# EAGLE schematic woolston_adsr (EAGLE 7.1.0)
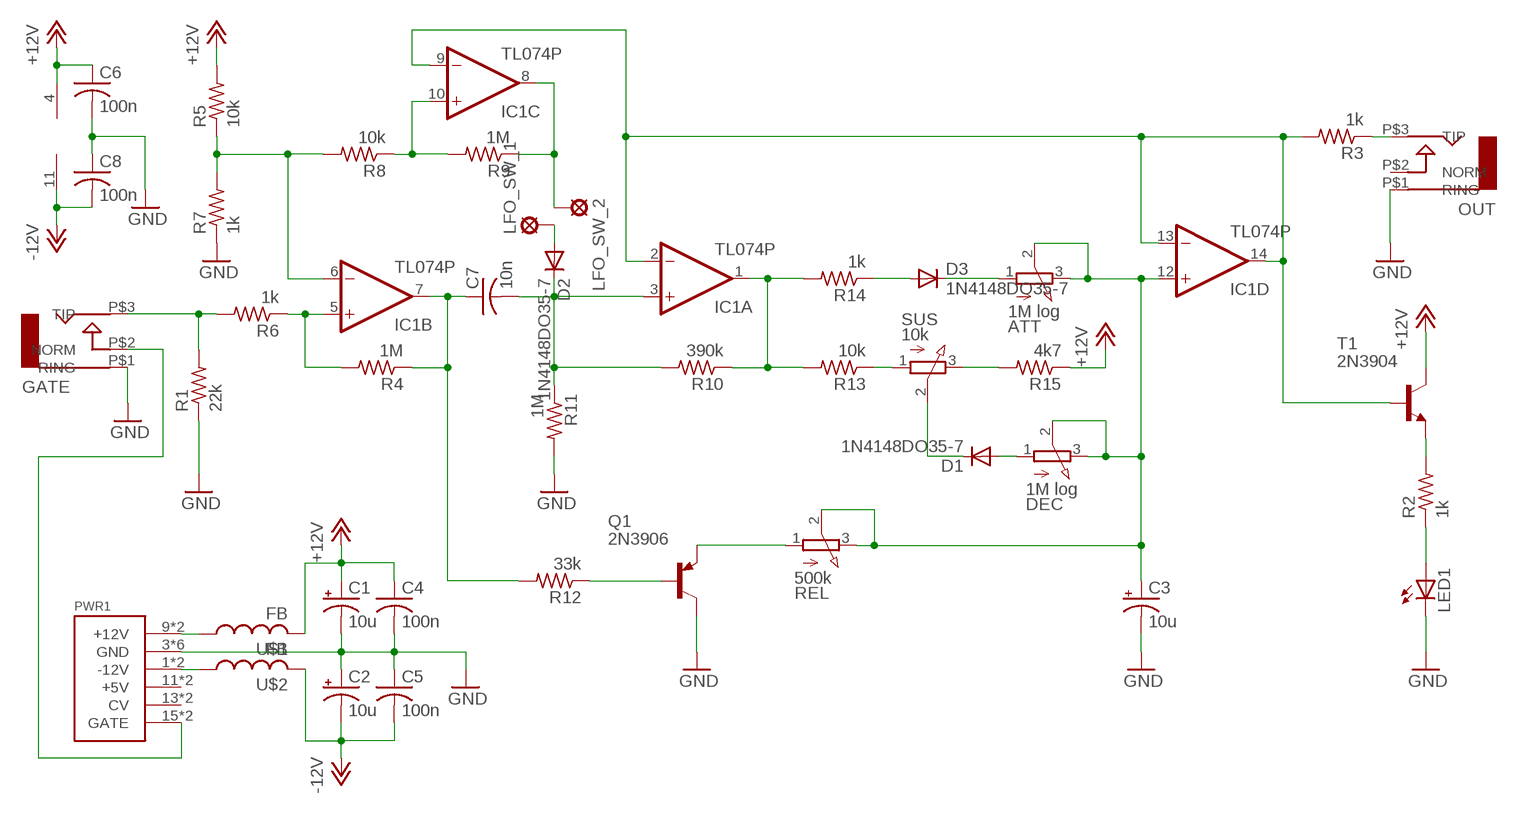
[diagram p0: schematic, sheet 1]

## Parts
ATT  1M log  3RP/1610N  [3RP/1610N]
C1  10u  CPOL-USB45181A  [B45181A]
C2  10u  CPOL-USB45181A  [B45181A]
C3  10u  CPOL-USB45181A  [B45181A]
C4  100n  C-US050-024X044  [C050-024X044]
C5  100n  C-US050-024X044  [C050-024X044]
C6  100n  C-US050-024X044  [C050-024X044]
C7  10n  C-US050-024X044  [C050-024X044]
C8  100n  C-US050-024X044  [C050-024X044]
D1  1N4148DO35-7  [DO35-7]
D2  1N4148DO35-7  [DO35-7]
D3  1N4148DO35-7  [DO35-7]
DEC  1M log  3RP/1610N  [3RP/1610N]
GATE  AUDIO-JACK  [ERTHENVAR-JACK-90DEG]
IC1  TL074P  [DIL14]
LED1  LED5MM  [LED5MM]
LFO_SW_1  LSP11  [LSP11]
LFO_SW_2  LSP11  [LSP11]
OUT  AUDIO-JACK  [ERTHENVAR-JACK-90DEG]
PWR1  POWER  [POWER_16]
Q1  2N3906  [TO92]
R1  22k  R-US_0207/10  [0207/10]
R2  1k  R-US_0207/10  [0207/10]
R3  1k  R-US_0207/10  [0207/10]
R4  1M  R-US_0207/10  [0207/10]
R5  10k  R-US_0207/10  [0207/10]
R6  1k  R-US_0207/10  [0207/10]
R7  1k  R-US_0207/10  [0207/10]
R8  10k  R-US_0207/10  [0207/10]
R9  1M  R-US_0207/10  [0207/10]
R10  390k  R-US_0207/10  [0207/10]
R11  1M  R-US_0207/10  [0207/10]
R12  33k  R-US_0207/10  [0207/10]
R13  10k  R-US_0207/10  [0207/10]
R14  1k  R-US_0207/10  [0207/10]
R15  4k7  R-US_0207/10  [0207/10]
REL  500k  3RP/1610N  [3RP/1610N]
SUS  10k  3RP/1610N  [3RP/1610N]
T1  2N3904  [TO92]
U$1  FB  [FB]
U$2  FB  [FB]

## Nets
+12V: C1.+ C4.1 C6.1 IC1.4(P:V+) R5.2 R15.1 T1.1(C) U$1.P$2
-12V: C2.- C5.2 C8.2 IC1.11(P:V-) U$2.P$2
GND: C1.- C2.+ C3.- C4.2 C5.1 C6.2 C8.1 GATE.P$1(RING) LED1.K(C) OUT.P$1(RING) PWR1.3(GND) PWR1.4(GND) PWR1.5(GND) PWR1.6(GND) PWR1.7(GND) PWR1.8(GND) Q1.1(C) R1.1 R7.1 R11.2
N$1: PWR1.9(+12V) PWR1.10(+12V) U$1.P$1
N$2: PWR1.1(-12V) PWR1.2(-12V) U$2.P$1
N$3: Q1.3(E) REL.1(A)
N$4: C7.1 IC1.7(B:OUT) R4.1 R12.2
N$5: R2.2 T1.3(E)
N$6: IC1.5(B:+IN) R4.2 R6.1
N$7: IC1.6(B:-IN) R5.1 R7.2 R8.2
N$8: LED1.A R2.1
N$9: D2.A LFO_SW_1.MP
N$10: IC1.10(C:+IN) R8.1 R9.2
N$11: Q1.2(B) R12.1
N$12: GATE.P$2(NORM) PWR1.15(GATE) PWR1.16(GATE)
N$13: IC1.8(C:OUT) LFO_SW_2.MP R9.1
N$14: GATE.P$3(TIP) R1.2 R6.2
N$15: OUT.P$3(TIP) R3.1
N$16: R13.1 SUS.1(A)
N$18: C7.2 D2.C IC1.3(A:+IN) R10.2 R11.1
N$19: IC1.2(A:-IN) IC1.9(C:-IN) IC1.13(D:-IN) IC1.14(D:OUT) R3.2 T1.2(B)
N$20: IC1.1(A:OUT) R10.1 R13.2 R14.2
N$21: D3.A R14.1
N$22: R15.2 SUS.3(E)
N$23: ATT.1(A) D3.C
N$24: D1.A DEC.1(A)
N$25: D1.C SUS.2(S)
N$26: ATT.2(S) ATT.3(E) C3.+ DEC.2(S) DEC.3(E) IC1.12(D:+IN) REL.2(S) REL.3(E)
Unconnected: OUT.P$2(NORM) PWR1.11(+5V) PWR1.12(+5V) PWR1.13(CV) PWR1.14(CV)

## Library data of the parts
ATT DEC REL SUS = pot:3RP/1610N: 16mm Potentiometer one level Source: http://www.alphapotentiometers.net/html/16mm_pot_2.html
C1-C3 = rcl:CPOL-US: POLARIZED CAPACITOR, American symbol
C4-C8 = rcl:C-US: CAPACITOR, American symbol
D1-D3 = diode:1N4148: DIODE high speed (Philips)
GATE OUT = erthenvar:AUDIO-JACK: Switching Mono 3.5mm Audio Jack from Erthenvar.
IC1 = linear:TL074: OP AMP
LED1 = led:LED: LED OSRAM: - CHIPLED LG R971, LG N971, LY N971, LG Q971, LY Q971, LO R971, LY R971 LH N974, LH R974 LS Q976, LO Q976, LY Q976 LO Q996 - Hyper CHIPLED LW Q18S LB Q993, LB Q99A, LB R99A - SideLED LS A670, LO A670, LY A670, LG A670, LP A670 LB A673, LV A673, LT A673, LW A673 LH A674 LY A675 LS A676, LA A676, LO A676, LY A676, LW A676 LS A679, LY A679, LG A679 - Hyper Micro SIDELED® LS Y876, LA Y876, LO Y876, LY Y876 LT Y87S - SmartLED LW L88C, LW L88S LB L89C, LB L89S, LG L890 LS L89K, LO L89K, LY L89K LS L896, LA L896, LO L896, LY L896 - TOPLED LS T670, LO T670, LY T670, LG T670, LP T670 LSG T670, LSP T670, LSY T670, LOP T670, LYG T670 LG T671, LOG T671, LSG T671 LB T673, LV T673, LT T673, LW T673 LH T674 LS T676, LA T676, LO T676, LY T676, LB T676, LH T676, LSB T676, LW T676 LB T67C, LV T67C, LT T67C, LS T67K, LO T67K, LY T67K, LW E67C LS E67B, LA E67B, LO E67B, LY E67B, LB E67C, LV E67C, LT E67C LW T67C LS T679, LY T679, LG T679 LS T770, LO T770, LY T770, LG T770, LP T770 LB T773, LV T773, LT T773, LW T773 LH T774 LS E675, LA E675, LY E675, LS T675 LS T776, LA T776, LO T776, LY T776, LB T776 LHGB T686 LT T68C, LB T68C - Hyper Mini TOPLED® LB M676 - Mini TOPLED Santana® LG M470 LS M47K, LO M47K, LY M47K Source: http://www.osram.convergy.de LUXEON: - LUMILED® LXK2-PW12-R00, LXK2-PW12-S00, LXK2-PW14-U00, LXK2-PW14-V00 LXK2-PM12-R00, LXK2-PM12-S00, LXK2-PM14-U00 LXK2-PE12-Q00, LXK2-PE12-R00, LXK2-PE12-S00, LXK2-PE14-T00, LXK2-PE14-U00 LXK2-PB12-K00, LXK2-PB12-L00, LXK2-PB12-M00, LXK2-PB14-N00, LXK2-PB14-P00, LXK2-PB14-Q00 LXK2-PR12-L00, LXK2-PR12-M00, LXK2-PR14-Q00, LXK2-PR14-R00 LXK2-PD12-Q00, LXK2-PD12-R00, LXK2-PD12-S00 LXK2-PH12-R00, LXK2-PH12-S00 LXK2-PL12-P00, LXK2-PL12-Q00, LXK2-PL12-R00 Source: www.luxeon.com KINGBRIGHT: KA-3528ASYC Source: www.kingbright.com
LFO_SW_1 LFO_SW_2 = solpad:LSP11: SOLDER PAD drill 1.1 mm
PWR1 = eurorack:POWER
Q1 = transistor-pnp:2N3906: PNP Transistor
R1-R15 = rcl:R-US_: RESISTOR, American symbol
T1 = transistor:2N3904: NPN TRANSISTOR
U$1 U$2 = adafruit:FB: Ferrite bead Digikey #P9821BK-ND